# Altium schematic sheet SHDN-S02-V00-ShutdownSegmentsBackup.SchDoc
size A3; DrawnBy: Jonn Dillon
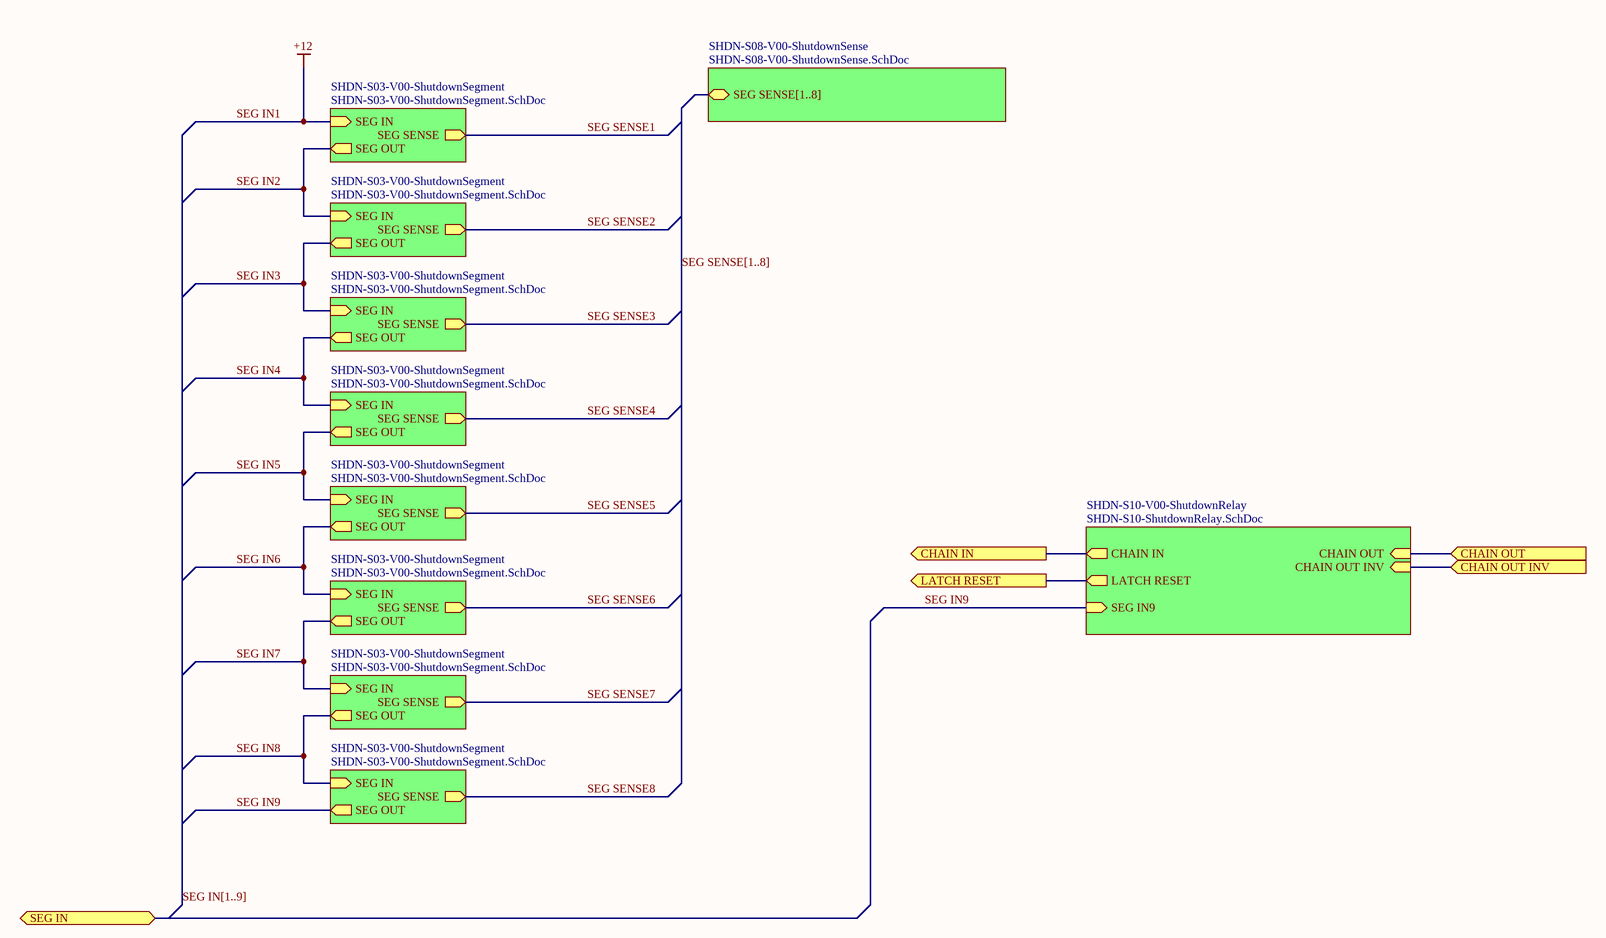
[diagram p0: SHDN-S02-V00-ShutdownSegmentsBackup.SchDoc]

## Sub-sheets
SHDN-S03-V00-ShutdownSegment = SHDN-S03-V00-ShutdownSegment.SchDoc: SEG SENSE (out), SEG OUT (out), SEG IN (in)
SHDN-S03-V00-ShutdownSegment = SHDN-S03-V00-ShutdownSegment.SchDoc: SEG SENSE (out), SEG OUT (out), SEG IN (in)
SHDN-S03-V00-ShutdownSegment = SHDN-S03-V00-ShutdownSegment.SchDoc: SEG SENSE (out), SEG OUT (out), SEG IN (in)
SHDN-S03-V00-ShutdownSegment = SHDN-S03-V00-ShutdownSegment.SchDoc: SEG SENSE (out), SEG OUT (out), SEG IN (in)
SHDN-S03-V00-ShutdownSegment = SHDN-S03-V00-ShutdownSegment.SchDoc: SEG SENSE (out), SEG OUT (out), SEG IN (in)
SHDN-S03-V00-ShutdownSegment = SHDN-S03-V00-ShutdownSegment.SchDoc: SEG SENSE (out), SEG OUT (out), SEG IN (in)
SHDN-S03-V00-ShutdownSegment = SHDN-S03-V00-ShutdownSegment.SchDoc: SEG SENSE (out), SEG OUT (out), SEG IN (in)
SHDN-S03-V00-ShutdownSegment = SHDN-S03-V00-ShutdownSegment.SchDoc: SEG SENSE (out), SEG OUT (out), SEG IN (in)
SHDN-S08-V00-ShutdownSense = SHDN-S08-V00-ShutdownSense.SchDoc: SEG SENSE[1..8] (bidir)
SHDN-S10-V00-ShutdownRelay = SHDN-S10-ShutdownRelay.SchDoc: CHAIN OUT (in), CHAIN OUT INV (in), CHAIN IN (out), LATCH RESET (out), SEG IN9 (in)

## Ports
CHAIN IN (out), CHAIN OUT (in), CHAIN OUT INV (in), LATCH RESET (out), SEG IN (bidir)

## Nets
SEG IN1: sheet SHDN-S03-V00-ShutdownSegment/SEG IN  [also labelled +12]
CHAIN IN: port CHAIN IN, sheet SHDN-S10-V00-ShutdownRelay/CHAIN IN
CHAIN OUT: port CHAIN OUT, sheet SHDN-S10-V00-ShutdownRelay/CHAIN OUT
CHAIN OUT INV: port CHAIN OUT INV, sheet SHDN-S10-V00-ShutdownRelay/CHAIN OUT INV
LATCH RESET: port LATCH RESET, sheet SHDN-S10-V00-ShutdownRelay/LATCH RESET
SEG IN2: sheet SHDN-S03-V00-ShutdownSegment/SEG OUT, sheet SHDN-S03-V00-ShutdownSegment/SEG IN
SEG IN3: sheet SHDN-S03-V00-ShutdownSegment/SEG OUT, sheet SHDN-S03-V00-ShutdownSegment/SEG IN
SEG IN4: sheet SHDN-S03-V00-ShutdownSegment/SEG OUT, sheet SHDN-S03-V00-ShutdownSegment/SEG IN
SEG IN5: sheet SHDN-S03-V00-ShutdownSegment/SEG OUT, sheet SHDN-S03-V00-ShutdownSegment/SEG IN
SEG IN6: sheet SHDN-S03-V00-ShutdownSegment/SEG OUT, sheet SHDN-S03-V00-ShutdownSegment/SEG IN
SEG IN7: sheet SHDN-S03-V00-ShutdownSegment/SEG OUT, sheet SHDN-S03-V00-ShutdownSegment/SEG IN
SEG IN8: sheet SHDN-S03-V00-ShutdownSegment/SEG OUT, sheet SHDN-S03-V00-ShutdownSegment/SEG IN
SEG IN9: sheet SHDN-S10-V00-ShutdownRelay/SEG IN9, sheet SHDN-S03-V00-ShutdownSegment/SEG OUT
SEG SENSE1: sheet SHDN-S03-V00-ShutdownSegment/SEG SENSE
SEG SENSE2: sheet SHDN-S03-V00-ShutdownSegment/SEG SENSE
SEG SENSE3: sheet SHDN-S03-V00-ShutdownSegment/SEG SENSE
SEG SENSE4: sheet SHDN-S03-V00-ShutdownSegment/SEG SENSE
SEG SENSE5: sheet SHDN-S03-V00-ShutdownSegment/SEG SENSE
SEG SENSE6: sheet SHDN-S03-V00-ShutdownSegment/SEG SENSE
SEG SENSE7: sheet SHDN-S03-V00-ShutdownSegment/SEG SENSE
SEG SENSE8: sheet SHDN-S03-V00-ShutdownSegment/SEG SENSE

## Buses and harness runs
bus SEG IN[1..9] = port SEG IN
bus SEG SENSE[1..8] = sheet SHDN-S08-V00-ShutdownSense/SEG SENSE[1..8]

## Notes on the sheet
- Revision History:
- Sheet Title:
- Rev
- Date
- Description
- Project:
- Size:
- Drawn By:
- A3
- Number:
- Revision:
- Sheet
- Version:
- of
- QUT Motorsport
- O-120, Gardens Point
- 2 George Street
- Brisbane, QLD 4000
- Australia
- Print Date:
- Print Time:
- File Name: